# Altium schematic sheet minna_schematic_cpu.SchDoc: Minna CPU
size A4; Author: Chris Hettrick; CompanyName: Populate All The Resistors; DrawnBy: Chris Hettrick; Engineer: Chris Hettrick; Organization: Populate All The Resistors; DocumentNumber: 1; Revision: 0.1; SheetNumber: 1; SheetTotal: 2; DocumentName: minna_schematic_cpu.SchDoc; ProjectName: smari
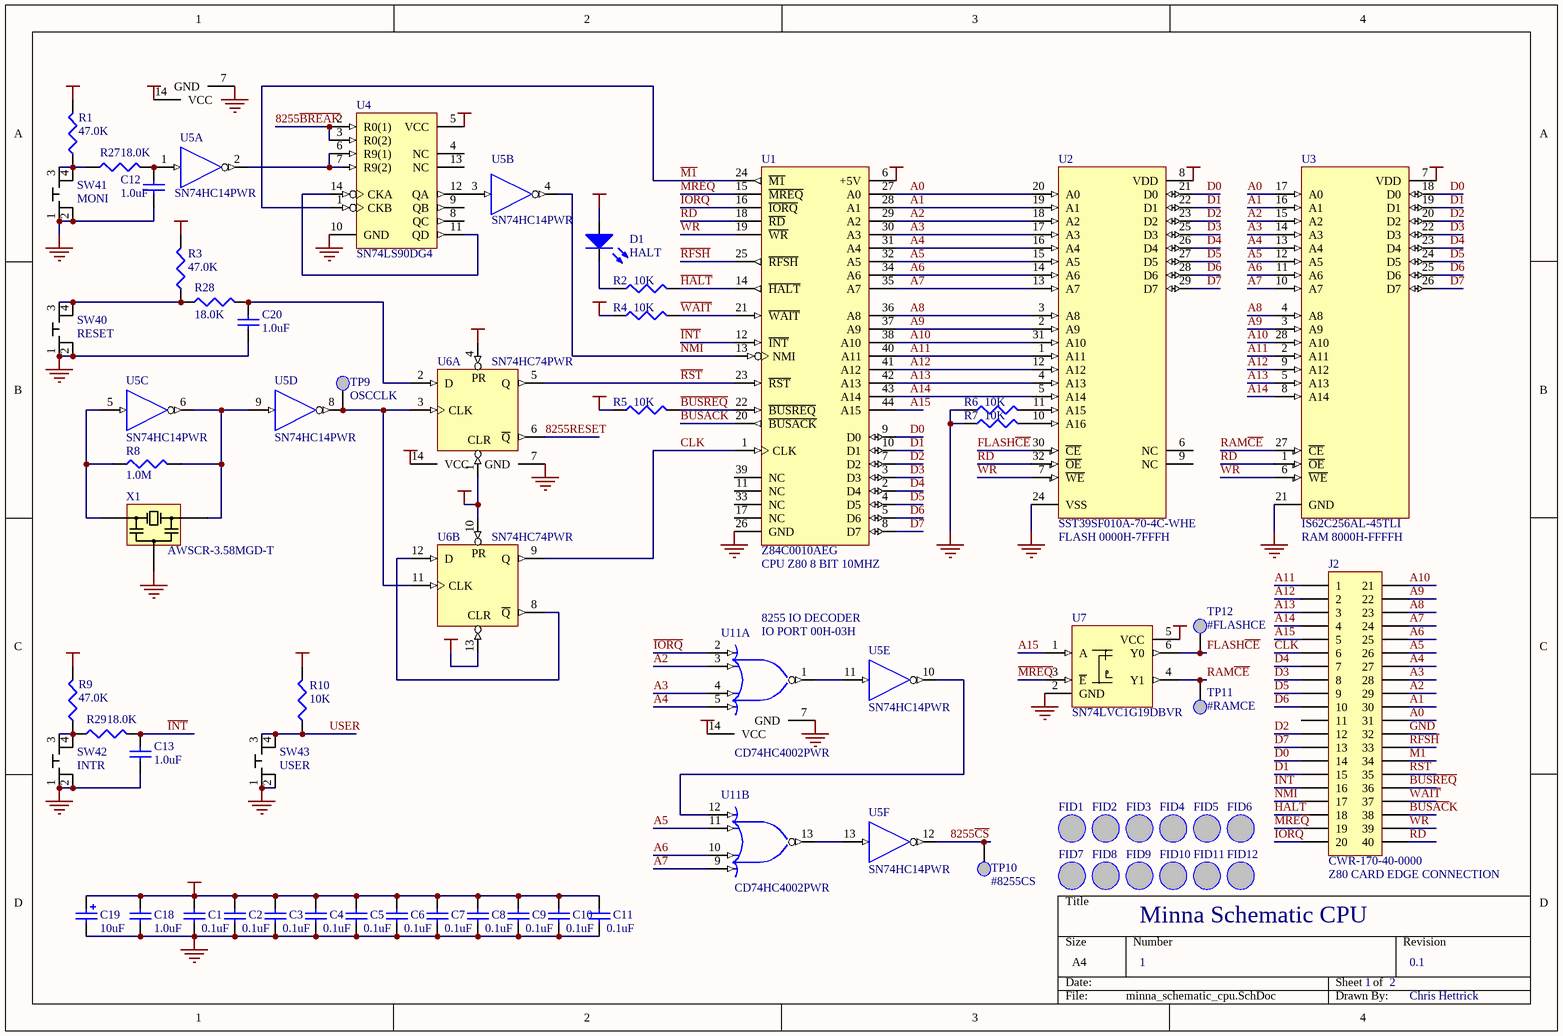
[diagram p0: minna_schematic_cpu.SchDoc]

## Parts
C1  0.1uF  [0603]
C2  0.1uF  [0603]
C3  0.1uF  [0603]
C4  0.1uF  [0603]
C5  0.1uF  [0603]
C6  0.1uF  [0603]
C7  0.1uF  [0603]
C8  0.1uF  [0603]
C9  0.1uF  [0603]
C10  0.1uF  [0603]
C11  0.1uF  [0603]
C12  1.0uF  [0805]
C13  1.0uF  [0805]
C18  1.0uF  [0805]
C19  10uF  [1206_A]
C20  1.0uF  [0805]
D1  HALT  [APG1608]
FID1  FIDUCIAL  [Fiducial]  (value not drawn)  (no BOM)
FID2  FIDUCIAL  [Fiducial]  (value not drawn)  (no BOM)
FID3  FIDUCIAL  [Fiducial]  (value not drawn)  (no BOM)
FID4  FIDUCIAL  [Fiducial]  (value not drawn)  (no BOM)
FID5  FIDUCIAL  [Fiducial]  (value not drawn)  (no BOM)
FID6  FIDUCIAL  [Fiducial]  (value not drawn)  (no BOM)
FID7  FIDUCIAL  [Fiducial]  (value not drawn)  (no BOM)
FID8  FIDUCIAL  [Fiducial]  (value not drawn)  (no BOM)
FID9  FIDUCIAL  [Fiducial]  (value not drawn)  (no BOM)
FID10  FIDUCIAL  [Fiducial]  (value not drawn)  (no BOM)
FID11  FIDUCIAL  [Fiducial]  (value not drawn)  (no BOM)
FID12  FIDUCIAL  [Fiducial]  (value not drawn)  (no BOM)
J2  CWR-170-40-0000  Notes: Z80 CARD EDGE CONNECTION  [CARD EDGE 40 PIN]
R1  47.0K  [0603]
R2  10K  [0603]
R3  47.0K  [0603]
R4  10K  [0603]
R5  10K  [0603]
R6  10K  [0603]
R7  10K  [0603]
R8  1.0M  [0603]
R9  47.0K  [0603]
R10  10K  [0603]
R27  18.0K  [0603]
R28  18.0K  [0603]
R29  18.0K  [0603]
SW40  RESET  [PTS645SM43SMTR LFS]
SW41  MONI  [PTS645SM43SMTR LFS]
SW42  INTR  [PTS645SM43SMTR LFS]
SW43  USER  [PTS645SM43SMTR LFS]
TP9  OSCCLK  [TP_ICT]  (no BOM)
TP10  #8255CS  [TP_ICT]  (no BOM)
TP11  #RAMCE  [TP_ICT]  (no BOM)
TP12  #FLASHCE  [TP_ICT]  (no BOM)
U1  Z84C0010AEG  Notes: CPU Z80 8 BIT 10MHZ  [LQFP-44]
U2  SST39SF010A-70-4C-WHE  Notes: FLASH 0000H-7FFFH  [SST39SF010A-70-4C-WHE]
U3  IS62C256AL-45TLI  Notes: RAM 8000H-FFFFH  [IS62C256AL-45TLI]
U4  SN74LS90DG4  [DO14]
U5  SN74HC14PWR  [PW014]  (parts A,B,C,D,E,F of 6)
U6  SN74HC74PWR  [PW014]  (parts A,B of 2)
U7  SN74LVC1G19DBVR  [SOT-23-6 DBV R-PDSO-G6]
U11  CD74HC4002PWR  [PW014]  (parts A,B of 2)
X1  AWSCR-3.58MGD-T  [AWSCR-MG]

## Nets
GND: C1.1 C2.1 C3.1 C4.1 C5.1 C6.1 C7.1 C8.1 C9.1 C10.1 C11.1 C12.1 C13.1 C18.2 C19.2 C20.1 J2.32 R6.1 R7.1 SW40.1 SW40.2 SW41.1 SW41.2 SW42.1 SW42.2 SW43.1 SW43.2 U1.26(GND) U2.24(VSS) U3.21(GND) U4.10(GND) U5.7(GND) U6.7(GND) U7.2(GND) U11.7(GND) X1.2
VCC: C1.2 C2.2 C3.2 C4.2 C5.2 C6.2 C7.2 C8.2 C9.2 C10.2 C11.2 C18.1 C19.1 D1.1(A) R1.2 R3.2 R4.1 R5.1 R9.2 R10.2 U1.6(+5V) U2.8(VDD) U3.7(VDD) U4.5(VCC) U5.14(VCC) U6.1(CLR) U6.4(PR) U6.10(PR) U6.13(CLR) U6.14(VCC) U7.5(VCC) U11.14(VCC)
8255~{BREAK}: U4.2(R0(1)) U4.3(R0(2))
8255~{CS}: TP10.TP U5.12(~{Y})
8255RESET: U6.6(~{Q})
A0: J2.31 U1.27(A0) U2.20(A0) U3.17(A0)
A1: J2.30 U1.28(A1) U2.19(A1) U3.16(A1)
A2: J2.29 U1.29(A2) U2.18(A2) U3.15(A2) U11.3(B)
A3: J2.28 U1.30(A3) U2.17(A3) U3.14(A3) U11.4(C)
A4: J2.27 U1.31(A4) U2.16(A4) U3.13(A4) U11.5(D)
A5: J2.26 U1.32(A5) U2.15(A5) U3.12(A5) U11.11(B)
A6: J2.25 U1.34(A6) U2.14(A6) U3.11(A6) U11.10(C)
A7: J2.24 U1.35(A7) U2.13(A7) U3.10(A7) U11.9(D)
A8: J2.23 U1.36(A8) U2.3(A8) U3.4(A8)
A9: J2.22 U1.37(A9) U2.2(A9) U3.3(A9)
A10: J2.21 U1.38(A10) U2.31(A10) U3.28(A10)
A11: J2.1 U1.40(A11) U2.1(A11) U3.2(A11)
A12: J2.2 U1.41(A12) U2.12(A12) U3.9(A12)
A13: J2.3 U1.42(A13) U2.4(A13) U3.5(A13)
A14: J2.4 U1.43(A14) U2.5(A14) U3.8(A14)
A15: J2.5 U1.44(A15) U7.1(A)
~{BUSAC}K: J2.38 U1.20(~{BUSACK})
~{BUSREQ}: J2.36 R5.2 U1.22(~{BUSREQ})
CLK: J2.6 U1.1(CLK) U6.9(Q)
D0: J2.14 U1.9(D0) U2.21(D0) U3.18(D0)
D1: J2.15 U1.10(D1) U2.22(D1) U3.19(D1)
D2: J2.12 U1.7(D2) U2.23(D2) U3.20(D2)
D3: J2.8 U1.3(D3) U2.25(D3) U3.22(D3)
D4: J2.7 U1.2(D4) U2.26(D4) U3.23(D4)
D5: J2.9 U1.4(D5) U2.27(D5) U3.24(D5)
D6: J2.10 U1.5(D6) U2.28(D6) U3.25(D6)
D7: J2.13 U1.8(D7) U2.29(D7) U3.26(D7)
FLASH~{CE}: TP12.TP U2.30(~{CE}) U7.6(Y0)
~{HALT}: J2.18 R2.2 U1.14(~{HALT})
~{INT}: C13.2 J2.16 R29.2 U1.12(~{INT})
~{IORQ}: J2.20 U1.16(~{IORQ}) U11.2(A)
~{M1}: J2.34 U1.24(~{M1}) U4.1(CKB)
~{MREQ}: J2.19 U1.15(~{MREQ}) U7.3(~{E})
NMI: J2.17 U1.13(NMI) U5.4(~{Y})
~{RD}: J2.40 U1.18(~{RD}) U2.32(~{OE}) U3.1(~{OE})
~{RFSH}: J2.33 U1.25(~{RFSH})
~{RST}: J2.35 U1.23(~{RST}) U6.5(Q)
RAM~{CE}: TP11.TP U3.27(~{CE}) U7.4(Y1)
USER: R10.1 SW43.3 SW43.4
~{WAIT}: J2.37 R4.2 U1.21(~{WAIT})
~{WR}: J2.39 U1.19(~{WR}) U2.7(~{WE}) U3.6(~{WE})
NetC12_2: C12.2 R27.2 U5.1(A)
NetC20_2: C20.2 R28.2 U6.2(D)
NetD1_2: D1.2(K) R2.1
NetR1_1: R1.1 R27.1 SW41.3 SW41.4
NetR3_1: R3.1 R28.1 SW40.3 SW40.4
NetR6_2: R6.2 U2.11(A15)
NetR7_2: R7.2 U2.10(A16)
NetR8_1: R8.1 U5.5(A) X1.3
NetR8_2: R8.2 U5.6(~{Y}) U5.9(A) X1.1
NetR9_1: R9.1 R29.1 SW42.3 SW42.4
NetTP9_TP: TP9.TP U5.8(~{Y}) U6.3(CLK) U6.11(CLK)
NetU4_6: U4.6(R9(1)) U4.7(R9(2)) U5.2(~{Y})
NetU4_11: U4.11(QD) U4.14(CKA)
NetU4_12: U4.12(QA) U5.3(A)
NetU5_10: U5.10(~{Y}) U11.12(A)
NetU5_11: U5.11(A) U11.1(Y)
NetU5_13: U5.13(A) U11.13(Y)
NetU6_8: U6.8(~{Q}) U6.12(D)

Not connected (* = marked no-connect by the designer): J2 11; U1 11(NC) 17(NC) 33(NC) 39(NC); U2 6(NC) 9(NC); U4 4(NC) 8(QC) 9(QB) 13(NC)

## Notes on the sheet
- (near U11) 8255 IO DECODER
- (near U11) IO PORT 00H-03H
- Minna Schematic CPU
- Title
- Size:
- Date:
- A4
- Number:
- Time:
- Revision:
- Sheet
- of
- File:

## Library data of the parts
C1-C11 = C0603: CAP .10UF 16V CERAMIC X7R 0603; Dist: Digikey; DistPN: 399-1096-1-ND; Load: yes; Mfgr: Kemet; MfgrPN: C0603C104K4RACTU; Polarized: no; Value: 0.1uF; Notes: *; Package: 0603
C12 C13 C18 C20 = C0805: CAP 1.0UF 16V CERAMIC X7R 0805; Dist: Digikey; DistPN: 399-1284-1-ND; Load: yes; Mfgr: Kemet; MfgrPN: C0805C105K4RACTU; Polarized: no; Value: 1.0uF; Package: 0805
  C13 C18: Notes: *
C19 = T491A: CAPACITOR TANT 10UF 10V 10% SMD; Dist: Digikey; DistPN: 399-3684-1-ND; Load: yes; Mfgr: Kemet; MfgrPN: T491A106K010AT; Value: 10uF; Notes: *; Package: 1206; Polarized: yes
D1 = LTST-C190KRKT: LED SUPER RED CLEAR 0603 SMD; Dist: Digikey; DistPN: 160-1436-2-ND; Load: yes; Mfgr: Lite-On; MfgrPN: LTST-C190KRKT; Package: 0603; Polarized: yes; Value: HALT
FID1-FID12 = FIDUCIAL: Load: DNP; Polarized: no; Dist: *; DistPN: *; Mfgr: *; MfgrPN: *; Notes: *; Value: FIDUCIAL; Package: *
J2 = CWR-170-40-0000: CONN CARD EDGE 40PIN GOLD; Dist: Digikey; DistPN: CCE40G-ND; Load: DNP; Mfgr: CW Industries; Polarized: yes; MfgrPN: CWR-170-40-0000; Package: *; Value: CWR-170-40-0000
R1 R3 R9 = MCR03EZPFX: RES 47.0K OHM 1/10W 1% 0603 SMD; Dist: Digikey; DistPN: P47.0KHCT-ND; Mfgr: Panasonic; MfgrPN: ERJ-3EKF4702V; Load: yes; Polarized: no; Value: 47.0K; Package: 0603
R2 R4-R7 R10 = MCR03EZPFX: RES 10.0K OHM 1/10W 1% 0603 SMD; Dist: Digikey; DistPN: P10.0KHCT-ND; Mfgr: Panasonic; MfgrPN: ERJ-3EKF1002V; Load: yes; Polarized: no; Value: 10K; Package: 0603
R8 = MCR03EZPFX: RES 1.00M OHM 1/10W 1% 0603 SMD; Dist: Digikey; DistPN: P1.00MHCT-ND; Mfgr: Panasonic; MfgrPN: ERJ-3EKF1004V; Load: yes; Polarized: no; Value: 1.0M; Package: 0603
R27-R29 = MCR03EZPFX: RES 18.0K OHM 1/10W 1% 0603 SMD; Dist: Digikey; DistPN: P18.0KHCT-ND; Mfgr: Panasonic; MfgrPN: ERJ-3EKF1802V; Load: yes; Polarized: no; Value: 18.0K; Package: 0603
SW40-SW43 = PTS645SM43SMTR LFS: SWITCH TACT 6MM 160GF H=4.3MM; Dist: Digikey; DistPN: CKN9112CT-ND; Load: yes; Mfgr: C&K Components; MfgrPN: PTS645SM43SMTR LFS; Package: SMD-6x6; Polarized: yes
  SW40: Value: RESET
  SW41: Value: MONI
  SW42: Value: INTR
  SW43: Value: USER
TP9-TP12 = TP_ICT: TEST POINT; Load: DNP; Polarized: no
  TP9: Value: OSCCLK
  TP10: Value: #8255CS
  TP11: Value: #RAMCE
  TP12: Value: #FLASHCE
U1 = Z84C0010AEG: IC Z80 CPU CMOS 10MHZ 44LQFP; Dist: Digikey; DistPN: 269-4574-ND; Load: yes; Mfgr: Zilog; MfgrPN: Z84C0010AEG; Package: LQFP-44; Polarized: yes; Value: Z84C0010AEG
U2 = SST39SF010A-70-4C-WHE: IC FLASH MPF 1MBIT 70NS 32TSOP; Dist: Digikey; DistPN: SST39SF010A-70-4C-WHE-ND; Load: yes; Mfgr: SST; MfgrPN: SST39SF010A-70-4C-WHE; Package: TSOP-32; Polarized: yes; Value: SST39SF010A-70-4C-WHE
U3 = IS62C256AL-45TLI: IC SRAM 256KBIT 45NS 28TSOP; Dist: Digikey; DistPN: 706-1109-ND; Load: yes; Mfgr: ISSI; MfgrPN: IS62C256AL-45TLI; Package: TSOP-28; Polarized: yes; Value: IS62C256AL-45TLI
U4 = SN74LS90DG4: IC COUNTER DECADE 4BIT 14SOIC; Dist: Digikey; DistPN: 296-3746-5-ND; Load: yes; Mfgr: Texas Instruments; MfgrPN: SN74LS90DG4; Package: SOIC-14; Polarized: yes; Value: SN74LS90DG4
U5 = SN74HC14PWR: IC HEX SCHMITT-TRIG INV 14-TSSOP; Dist: Digikey; DistPN: 296-8234-1-ND; Load: yes; Mfgr: Texas Instruments; MfgrPN: SN74HC14PWR; Package: TSSOP-14; Polarized: yes; Value: SN74HC14PWR
U6 = SN74HC74PWR: IC DUAL F-F W/CLR/PRESET 14TSSOP; Dist: Digikey; DistPN: 296-8372-1-ND; Load: yes; Mfgr: Texas Instruments; MfgrPN: SN74HC74PWR; Package: TSSOP-14; Polarized: yes; Value: SN74HC74PWR
U7 = SN74LVC1G19DBVR: IC MUX/DECODER SNGL 1OF2 SOT23-6; Dist: Digikey; DistPN: 296-17991-1-ND; Load: yes; Mfgr: Texas Instruments; MfgrPN: SN74LVC1G19DCKR; Package: TSSOP-6; Polarized: yes; Value: SN74LVC1G19DBVR
U11 = CD74HC4002PWR: IC DUAL 4-IN NOR GATE 14TSSOP; Dist: Digikey; DistPN: 296-31585-1-ND; Load: yes; Mfgr: Texas Instruments; MfgrPN: CD74HC4002PWR; Notes: *; Package: TSSOP-14; Polarized: yes; Value: CD74HC4002PWR
X1 = AWSCR-3.58MGD-T: RESONATOR CER 3.58MHZ W/CAP SMD; Dist: Digikey; DistPN: 535-9365-1-ND; Load: yes; Mfgr: Abracon; Polarized: no; Value: AWSCR-3.58MGD-T; MfgrPN: AWSCR-3.58MGD-T; Package: SMD-7.4x3.4